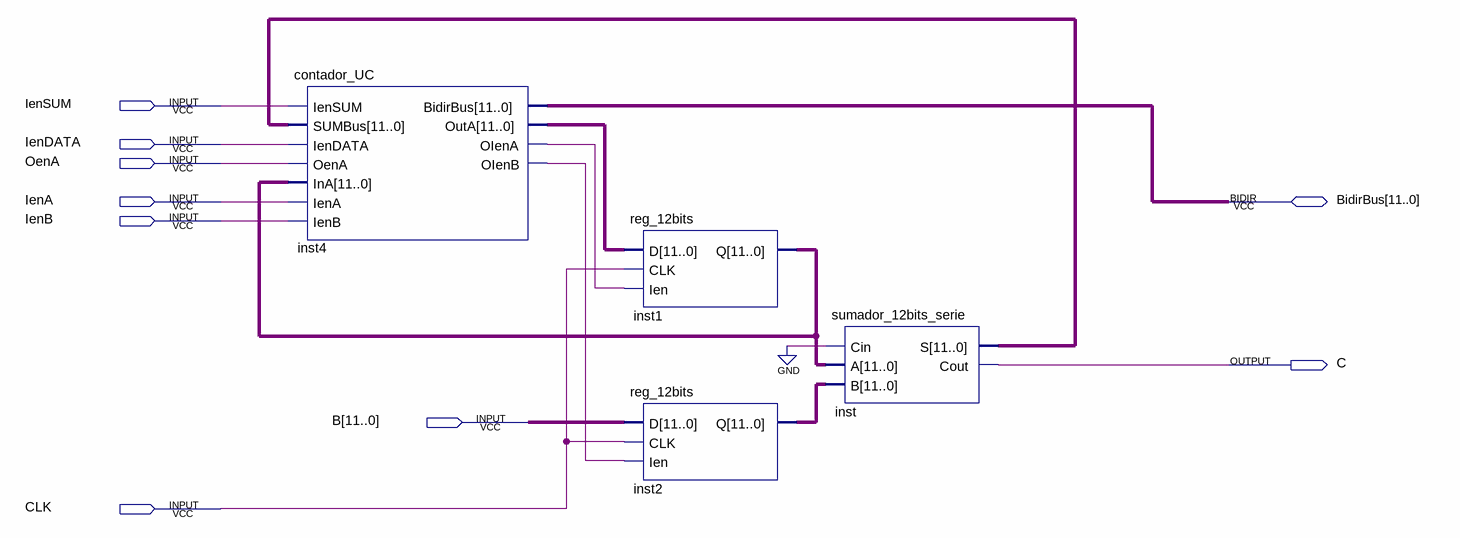
[diagram p0: schematic sheet]
// Quartus schematic contador.bdf as structural Verilog: 4 symbols, 9 pins
module contador (
  input  IenSUM,
  input  IenDATA,
  input  OenA,
  input  IenA,
  input  IenB,
  input  [11:0] B,
  input  CLK,
  inout  [11:0] BidirBus,
  output C
);

  wire inst4_oiena, inst4_oienb;
  wire [11:0] inst1_q, inst2_q, inst4_outa, inst_s;

  contador_UC inst4 (
    .IenSUM(IenSUM), .SUMBus(inst_s), .IenDATA(IenDATA), .OenA(OenA), .InA(inst1_q), .IenA(IenA),
    .IenB(IenB), .OutA(inst4_outa), .OIenA(inst4_oiena), .OIenB(inst4_oienb), .BidirBus(BidirBus));
  reg_12bits inst1 (.D(inst4_outa), .CLK(CLK), .Ien(inst4_oiena), .Q(inst1_q));
  reg_12bits inst2 (.D(B), .CLK(CLK), .Ien(inst4_oienb), .Q(inst2_q));
  sumador_12bits_serie inst (.Cin(1'b0), .A(inst1_q), .B(inst2_q), .S(inst_s), .Cout(C));
endmodule
